# EAGLE design XOR or XNOR gate (EAGLE 5.11)
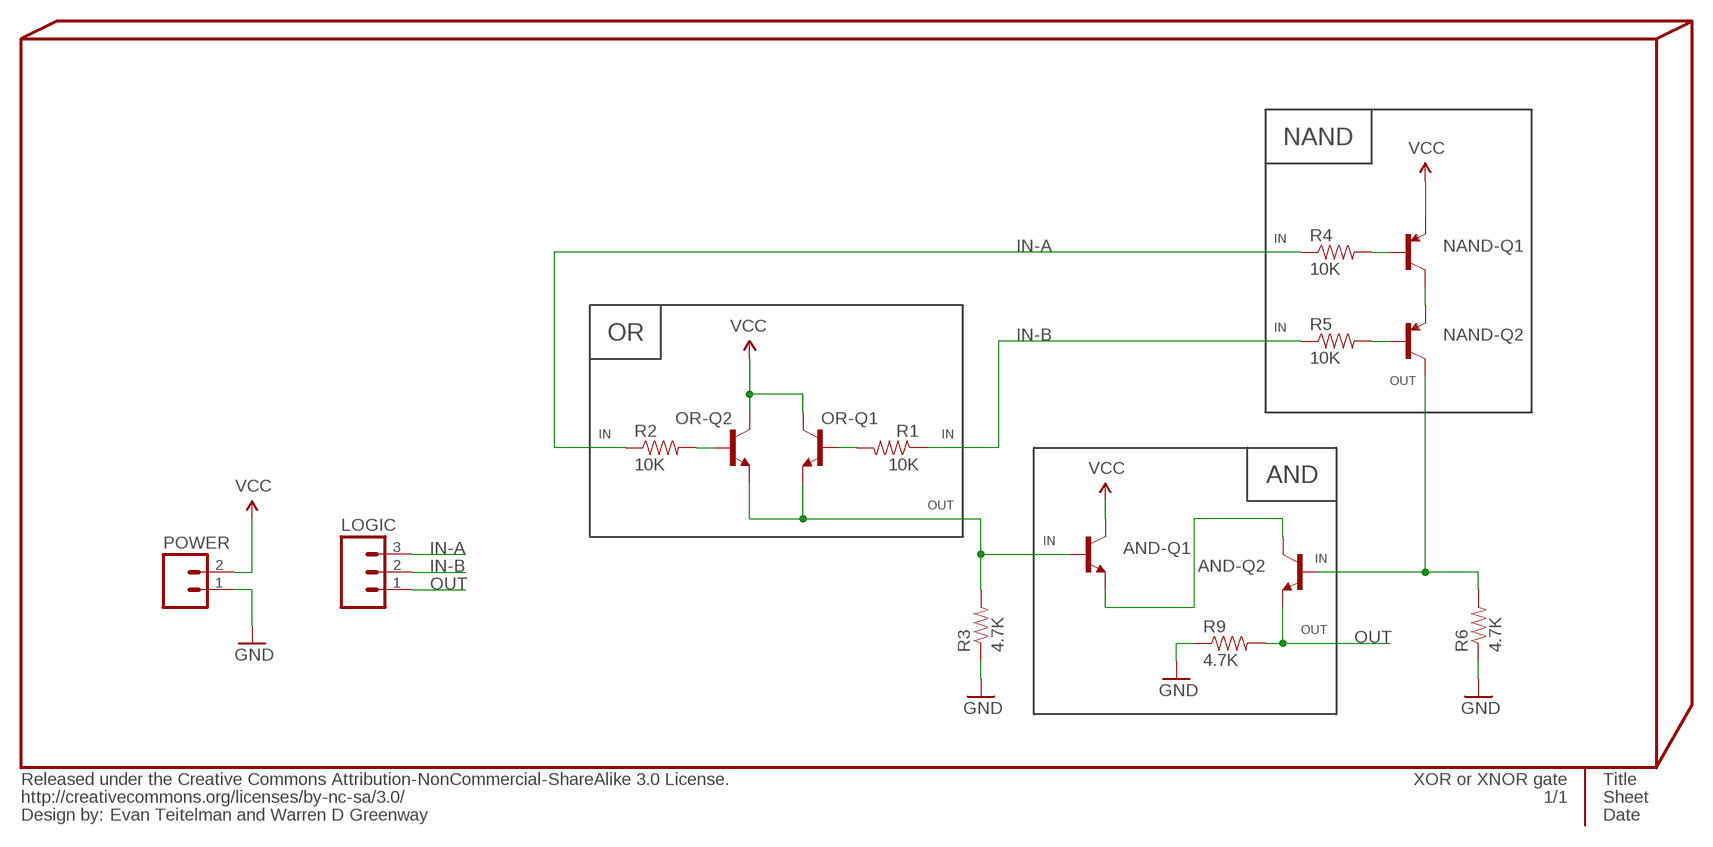
[diagram p0: schematic, sheet 1]

## Parts
AND-Q1  TRANSISTOR_NPNSOT23  [SOT23]
AND-Q2  TRANSISTOR_NPNSOT23  [SOT23]
INFO4  Evan Teitelman and Warren D Greenway  %CC-NC-SA  [%CC-NC-SA]
LOGIC  M03PTH  [1X03]
NAND-Q1  TRANSISTOR_PNPSOT23  [SOT23]
NAND-Q2  TRANSISTOR_PNPSOT23  [SOT23]
OR-Q1  TRANSISTOR_NPNSOT23  [SOT23]
OR-Q2  TRANSISTOR_NPNSOT23  [SOT23]
POWER  M02PTH  [1X02]
R1  10K  RESISTOR0402-RES  [0402-RES]
R2  10K  RESISTOR0402-RES  [0402-RES]
R3  4.7K  RESISTOR0402-RES  [0402-RES]
R4  10K  RESISTOR0402-RES  [0402-RES]
R5  10K  RESISTOR0402-RES  [0402-RES]
R6  4.7K  RESISTOR0402-RES  [0402-RES]
R9  4.7K  RESISTOR0402-RES  [0402-RES]

## Nets
GND: POWER.1 R3.1 R6.1 R9.1 ; supply symbol labelled @GND
IN-A: LOGIC.3 R2.1 R4.1
IN-B: LOGIC.2 R1.1 R5.1
N$1: NAND-Q1.2(C) NAND-Q2.3(E)
N$2: NAND-Q1.1(B) R4.2
N$3: OR-Q1.1(B) R1.2
N$4: OR-Q2.1(B) R2.2
N$5: NAND-Q2.1(B) R5.2
N$6: AND-Q1.2(E) AND-Q2.3(C)
NAND-OUT: AND-Q2.1(B) NAND-Q2.2(C) R6.2
OR-OUT: AND-Q1.1(B) OR-Q1.2(E) OR-Q2.2(E) R3.2
OUT: AND-Q2.2(E) LOGIC.1 R9.2
VCC: AND-Q1.3(C) NAND-Q1.3(E) OR-Q1.3(C) OR-Q2.3(C) POWER.2 ; supply symbol labelled @VCC

## Notes on the sheet
- NAND
- IN
- IN
- OR
- OUT
- IN | IN
- AND
- OUT
- IN
- IN
- OUT

## Library data of the parts
AND-Q1 AND-Q2 OR-Q1 OR-Q2 = SparkFun:TRANSISTOR_NPN: Transistor NPN BJT configuration in SOT23 package. MMBT2222 is the common NPN we use. Double check BCE configuration again layout.
INFO4 = PygmyBoards:%CC-NC-SA: Released under the Creative Commons Attribution-NonCommercial-ShareAlike 3.0 License. http://creativecommons.org/licenses/by-sa/3.0 Design by: [Designer Name] Change this part's value to change the designer name
LOGIC = SparkFun:M03: Header 3 Standard 3-pin 0.1" header. Use with straight break away headers (SKU : PRT-00116), right angle break away headers (PRT-00553), swiss pins (PRT-00743), machine pins (PRT-00117), and female headers (PRT-00115). Molex polarized connector foot print use with SKU : PRT-08232 with associated crimp pins and housings.
NAND-Q1 NAND-Q2 = Pygmy:TRANSISTOR_PNP
POWER = SparkFun:M02: Header 2 Standard 2-pin 0.1" header. Use with straight break away headers (SKU : PRT-00116), right angle break away headers (PRT-00553), swiss pins (PRT-00743), machine pins (PRT-00117), and female headers (PRT-00115). Molex polarized connector foot print use with SKU : PRT-08233 with associated crimp pins and housings.
R1-R6 R9 = SparkFun:RESISTOR: Resistor Basic schematic elements and footprints for 0603, 1206, and PTH resistors.

## Board
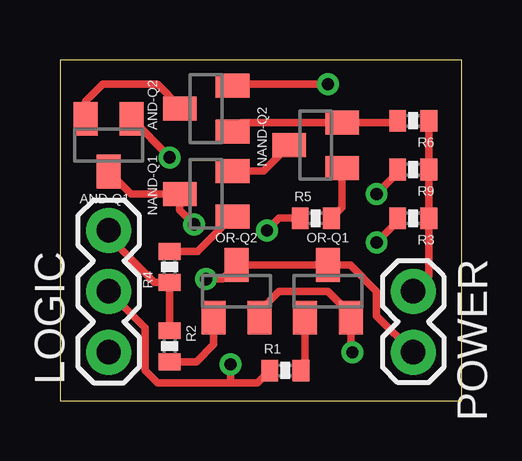
[diagram p1: board, top side]
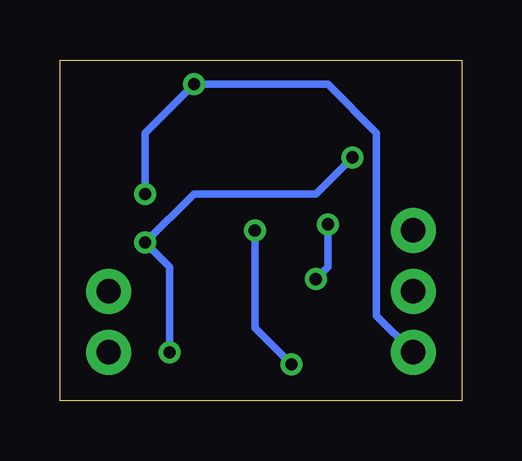
[diagram p2: board, bottom side, seen from below]

Size 16.76 x 14.22 mm. Coordinates in mm from the lower left corner, seen from the top.
Outline: 0,0 16.76,0 16.76,14.22 0,14.22 0,0
Copper layers (1*16): Top 0.035mm / dielectric 1.5mm / Bottom 0.035mm
Design rules "PDX (Production)": minimum track width 6mil, minimum drill 13mil, track to track 6mil, track to pad 6mil, pad to pad 4mil, via to via 6mil, smd to smd 4mil, copper to edge 15mil, drill to drill 6mil, minimum pad ring 10mil, minimum via ring 8mil, stop-mask expansion 4mil, vias tented up to drill 25mil, thermal gap 10mil

### Footprints (pad centres in the part's own frame; a part is rotated, then mirrored left to right if it is on the bottom)
SOT23 = smd 1 x 1.4: 1 -0.95,-1.1; 2 0.95,-1.1; 3 0,1.1
1X03 = drill 1.016 pad 1.88 round: 1 0,0; 2 2.54,0; 3 5.08,0
1X02 = drill 1.016 pad 1.88 round: 1 0,0; 2 2.54,0
0402-RES = smd 0.7 x 0.9: 1 -0.65,0; 2 0.65,0

### Placement (x,y rotation side)
AND-Q1  2.03,10.67 180 top
AND-Q2  6.1,12.19 90 top
INFO4  0,-7.62 0 top  (outside the outline)
LOGIC  2.03,2.03 90 top
NAND-Q1  6.1,8.64 90 top
NAND-Q2  10.67,10.67 90 top
OR-Q1  11.18,4.57 0 top
OR-Q2  7.37,4.57 0 top
POWER  14.73,4.57 270 top
R1  9.4,1.27 0 top
R2  4.57,2.29 270 top
R3  14.73,7.62 180 top
R4  4.57,5.59 90 top
R5  10.67,7.62 0 top
R6  14.73,11.68 180 top
R9  14.73,9.65 180 top

### Tracks (layer width: path | path; a pad name or v marks a point on that pad's centre or on a via)
GND
  Top 0.305: R6.1 R9.1 15.38,8.13 R3.1 15.38,5.22 POWER.1
IN-A
  Top 0.305: R2.1 R4.1 3.95,4.94 2.03,6.86 LOGIC.3
IN-B  (via drill 0.51)
  Top 0.305: R1.1 8.24,0.76 7.11,0.76 | 7.11,0.76 4.06,0.76 3.56,1.27 3.56,3.05 LOGIC.2 | R5.1 9.14,7.62 v8.64,7.11 | 7.11,0.76 v7.11,1.52
  Bottom 0.305: v8.64,7.11 8.64,3.05 v7.11,1.52
N$1
  Top 0.305: NAND-Q1.2 8.49,9.59 NAND-Q2.3
N$2
  Top 0.305: NAND-Q1.1 5.75,6.24 R4.2
N$3
  Top 0.305: R1.2 10.23,1.45 OR-Q1.1
N$4
  Top 0.305: R2.2 5.7,1.64 6.42,2.35 OR-Q2.1
N$5
  Top 0.305: R5.2 11.77,8.07 NAND-Q2.1
N$6
  Top 0.305: AND-Q2.3 5,12.28 4.06,13.21 1.78,13.21 1.08,12.51 AND-Q1.2
NAND-OUT
  Top 0.305: R6.2 14.02,11.62 NAND-Q2.2 7.57,11.62 AND-Q2.1
OR-OUT  (via drill 0.51)
  Top 0.305: v12.19,2.03 12.13,2.1 OR-Q1.2 12.13,3.62 11.18,4.57 9.14,4.57 8.32,3.74 OR-Q2.2 | AND-Q1.1 4.57,10.18 v4.57,10.16 | R3.2 14.08,7.48 v13.21,6.6
  Bottom 0.305: v12.19,2.03 12.19,5.59 v13.21,6.6 11.18,8.64 6.1,8.64 v4.57,10.16
OUT  (via drill 0.51)
  Top 0.305: AND-Q2.2 7.26,13.21 v11.18,13.21 | v13.21,8.64 14.08,9.51 R9.2
  Bottom 0.305: v13.21,8.64 13.21,11.18 v11.18,13.21 5.59,13.21 3.56,11.18 3.56,3.56 LOGIC.1
VCC  (via drill 0.51)
  Top 0.305: AND-Q1.3 2.96,8.64 NAND-Q1.3 5,7.96 v5.59,7.37 | POWER.2 13.21,3.56 13.21,4.57 12.11,5.67 OR-Q1.3 OR-Q2.3 6.77,5.08 v6.1,5.08
  Bottom 0.305: v5.59,7.37 5.59,5.59 v6.1,5.08

### Text on the board
_bsilk: AND | Out | In-B | Gnd | In-A | Vcc